# Altium project PicoDaisy.PrjPcb
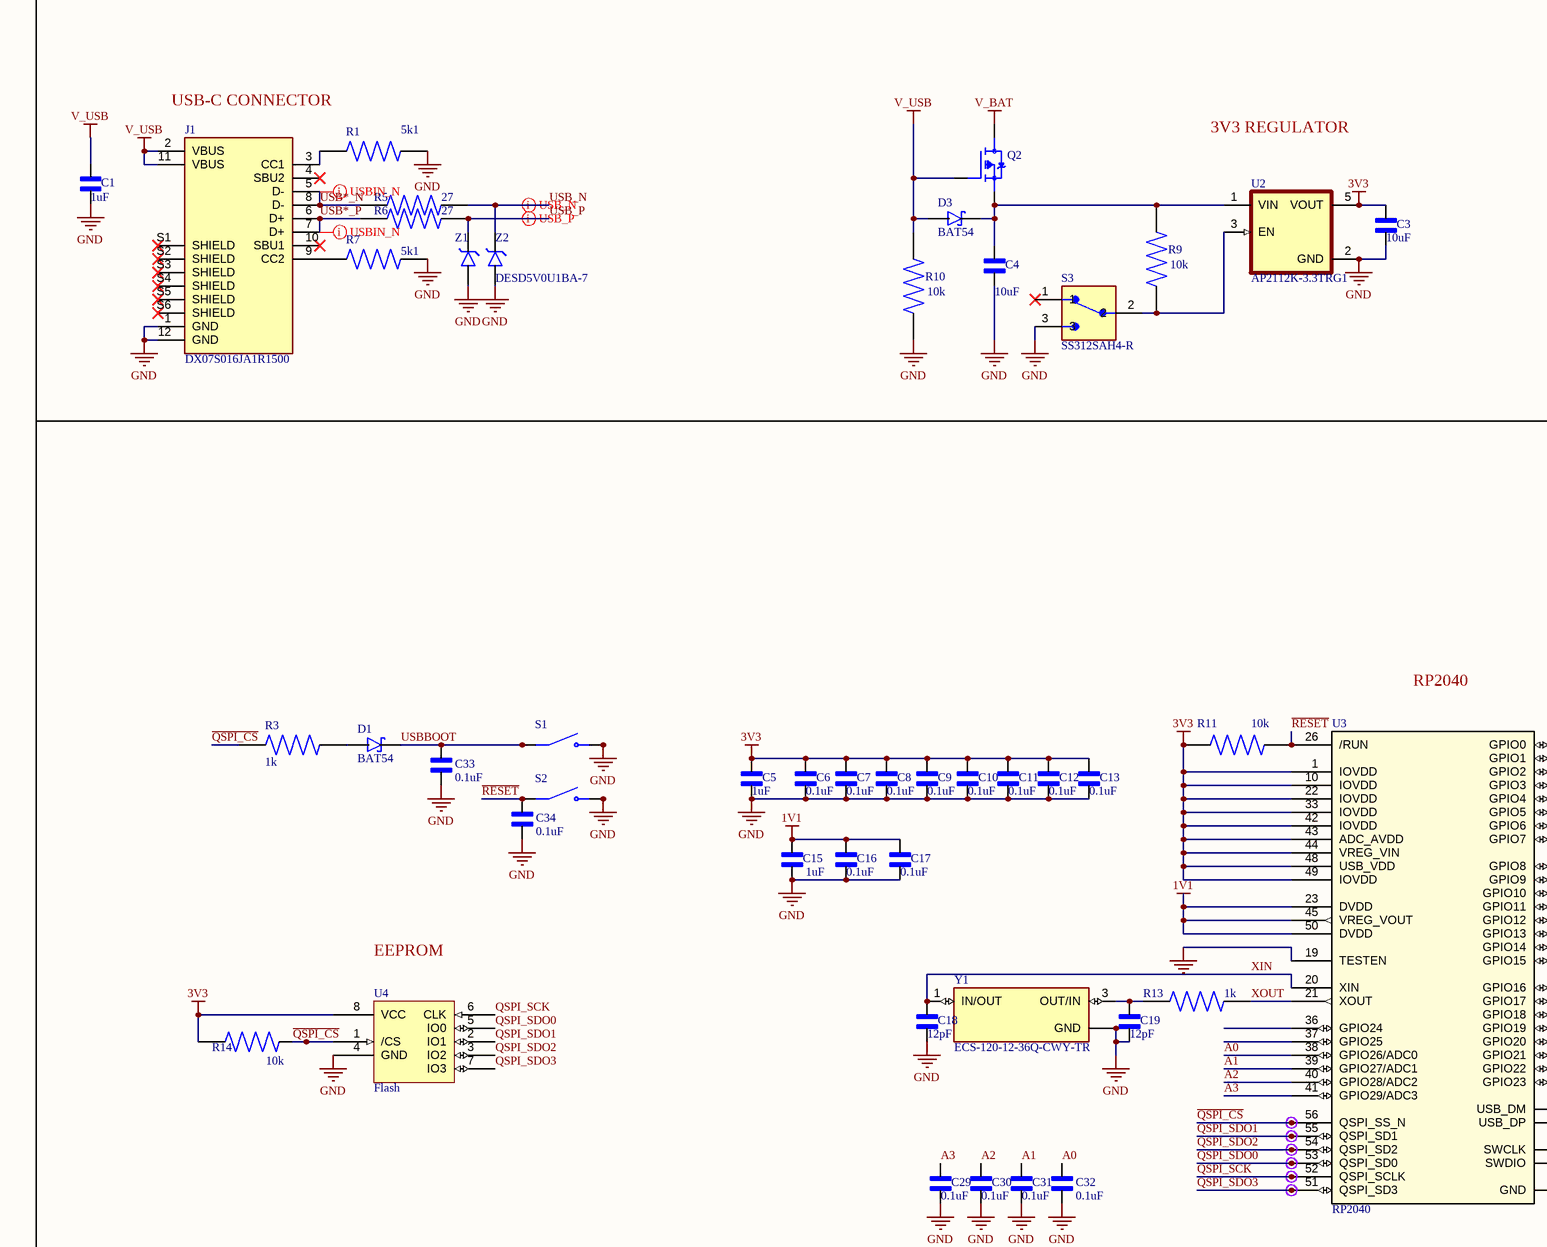
[diagram p0: PicoDaisy.SchDoc, top left]
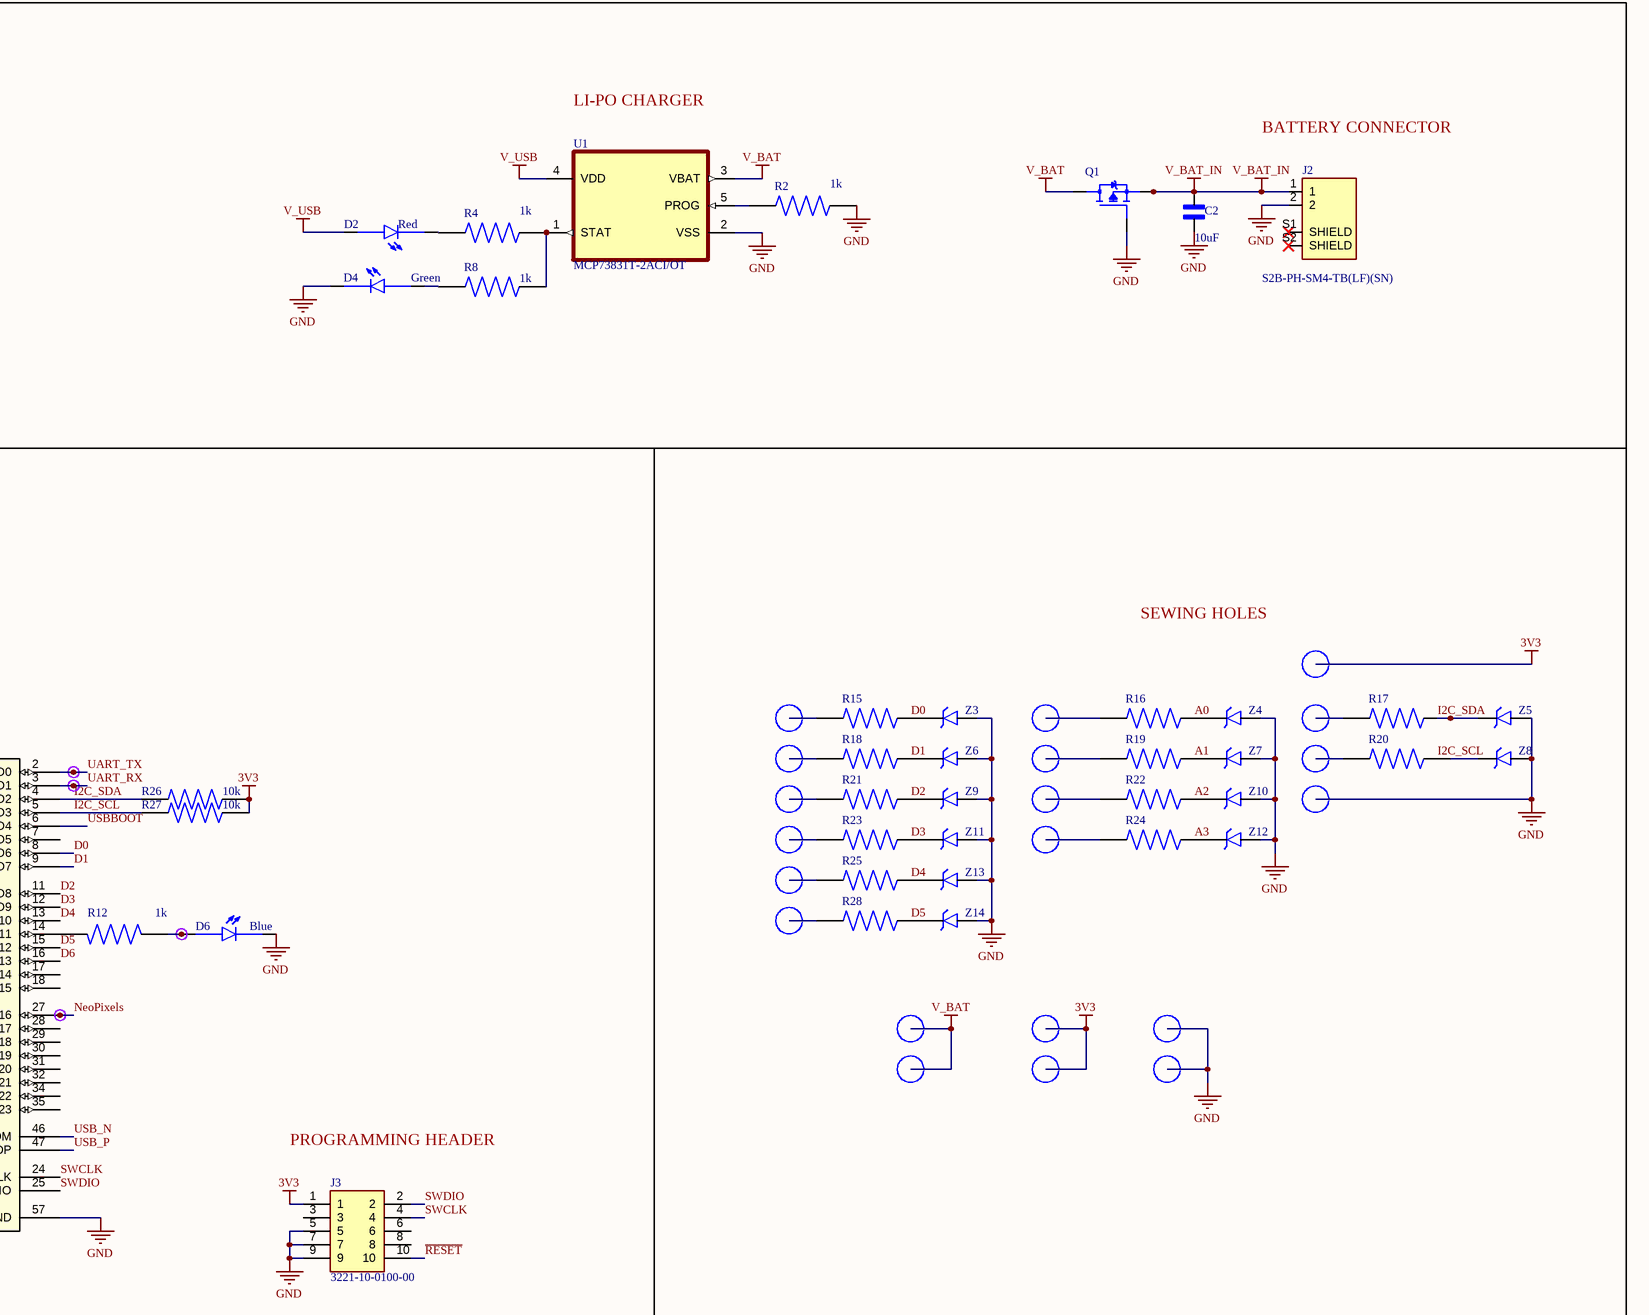
[diagram p1: PicoDaisy.SchDoc, top right]
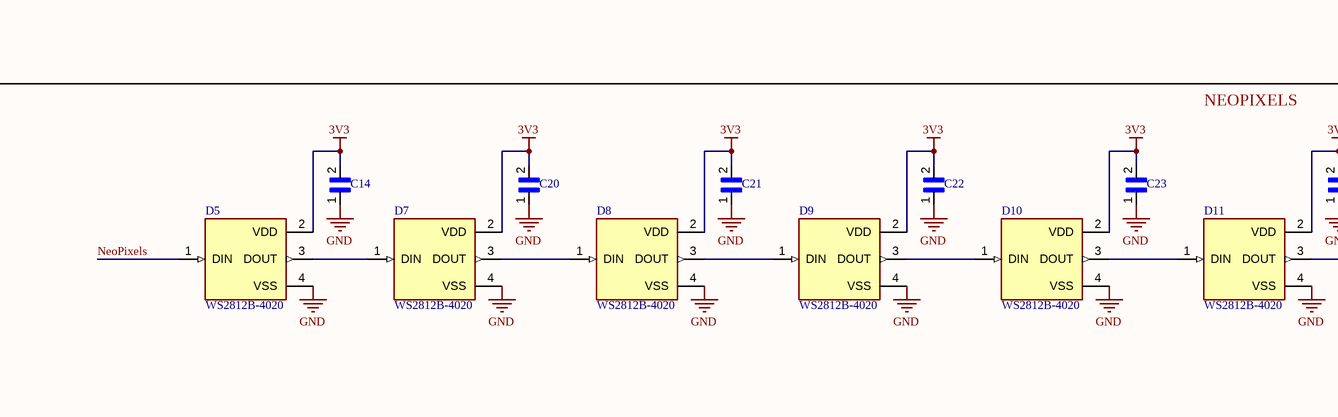
[diagram p2: PicoDaisy.SchDoc, bottom left]
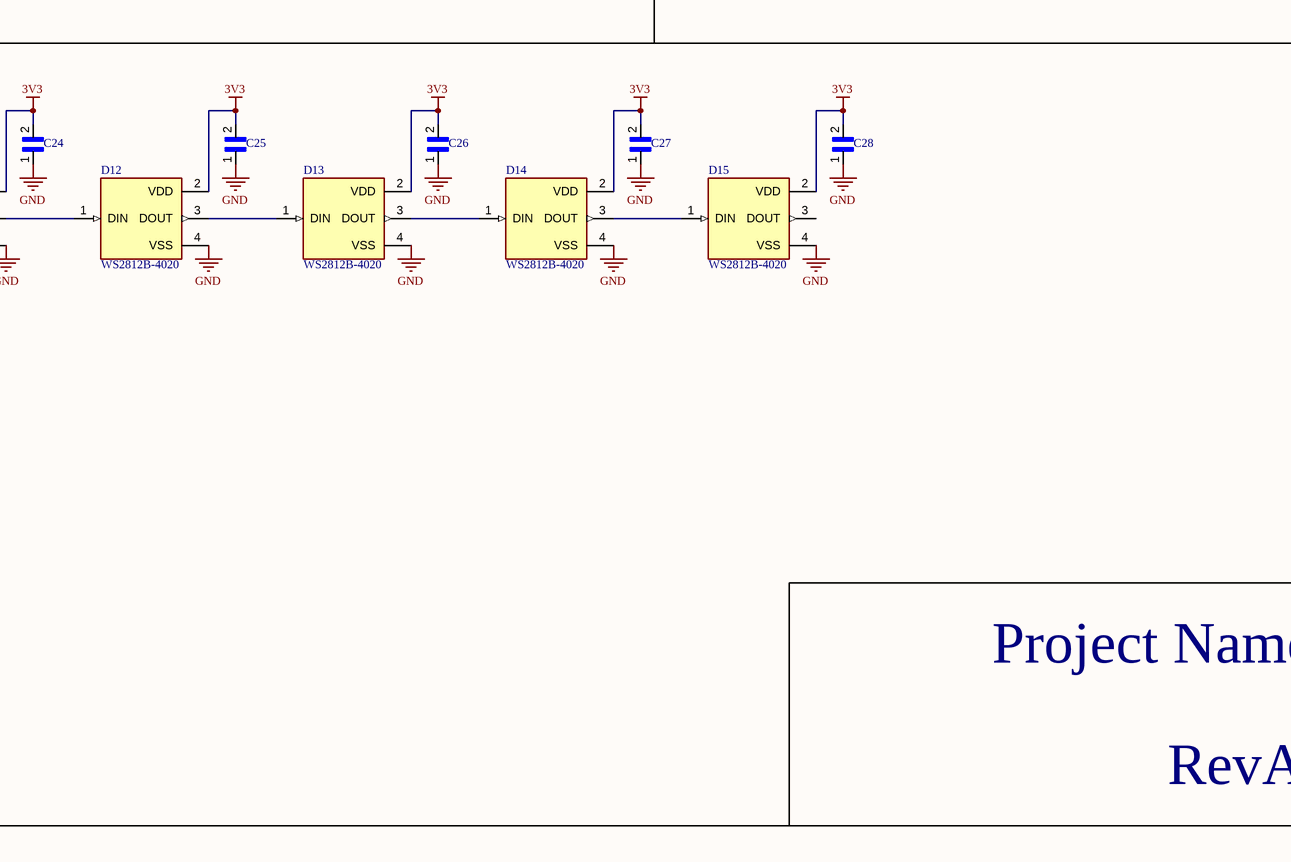
[diagram p3: PicoDaisy.SchDoc, bottom right]
1 sheet, 134 parts. Net scope: global (net labels, ports and power ports of the same name join across sheets).
Board file: PicoDaisy.PcbDoc

## Sheet PicoDaisy.SchDoc
size 594 x 420 mm; SheetNumber: 1; SheetTotal: 1

### Parts
C1  value 1uF  [CAPC1608X100N]  (hidden comment: GRM188R61E106KA73J)
C2  value 10uF  [CAPC1608X100N]  (hidden comment: GRM188R61E106KA73J)
C3  value 10uF  [CAPC1608X100N]  (hidden comment: GRM188R61E106KA73J)
C4  value 10uF  [CAPC1608X100N]  (hidden comment: GRM188R61E106KA73J)
C5  value 1uF  [CAPC1608X100N]  (hidden comment: GRM188R61E106KA73J)
C6  value 0.1uF  [CAPC1608X100N]  (hidden comment: GRM188R61E106KA73J)
C7  value 0.1uF  [CAPC1608X100N]  (hidden comment: GRM188R61E106KA73J)
C8  value 0.1uF  [CAPC1608X100N]  (hidden comment: GRM188R61E106KA73J)
C9  value 0.1uF  [CAPC1608X100N]  (hidden comment: GRM188R61E106KA73J)
C10  value 0.1uF  [CAPC1608X100N]  (hidden comment: GRM188R61E106KA73J)
C11  value 0.1uF  [CAPC1608X100N]  (hidden comment: GRM188R61E106KA73J)
C12  value 0.1uF  [CAPC1608X100N]  (hidden comment: GRM188R61E106KA73J)
C13  value 0.1uF  [CAPC1608X100N]  (hidden comment: GRM188R61E106KA73J)
C14  C0603X104K5RAC7867  [CAPC1608X100N]  (value not drawn)
C15  value 1uF  [CAPC1608X100N]  (hidden comment: GRM188R61E106KA73J)
C16  value 0.1uF  [CAPC1608X100N]  (hidden comment: GRM188R61E106KA73J)
C17  value 0.1uF  [CAPC1608X100N]  (hidden comment: GRM188R61E106KA73J)
C18  value 12pF  [CAPC1608X100N]  (hidden comment: GRM188R61E106KA73J)
C19  value 12pF  [CAPC1608X100N]  (hidden comment: GRM188R61E106KA73J)
C20  C0603X104K5RAC7867  [CAPC1608X100N]  (value not drawn)
C21  C0603X104K5RAC7867  [CAPC1608X100N]  (value not drawn)
C22  C0603X104K5RAC7867  [CAPC1608X100N]  (value not drawn)
C23  C0603X104K5RAC7867  [CAPC1608X100N]  (value not drawn)
C24  C0603X104K5RAC7867  [CAPC1608X100N]  (value not drawn)
C25  C0603X104K5RAC7867  [CAPC1608X100N]  (value not drawn)
C26  C0603X104K5RAC7867  [CAPC1608X100N]  (value not drawn)
C27  C0603X104K5RAC7867  [CAPC1608X100N]  (value not drawn)
C28  C0603X104K5RAC7867  [CAPC1608X100N]  (value not drawn)
C29  value 0.1uF  [CAPC1608X100N]  (hidden comment: GRM188R61E106KA73J)
C30  value 0.1uF  [CAPC1608X100N]  (hidden comment: GRM188R61E106KA73J)
C31  value 0.1uF  [CAPC1608X100N]  (hidden comment: GRM188R61E106KA73J)
C32  value 0.1uF  [CAPC1608X100N]  (hidden comment: GRM188R61E106KA73J)
C33  value 0.1uF  [CAPC1608X100N]  (hidden comment: GRM188R61E106KA73J)
C34  value 0.1uF  [CAPC1608X100N]  (hidden comment: GRM188R61E106KA73J)
D1  BAT54  [SOT23]
D2  Red  [LEDC1608X35N]
D3  BAT54  [SOT23]
D4  Green  [LEDC1608X35N]
D5  WS2812B-4020  [LED_WS2812B-4020]
D6  Blue  [LEDC1608X35N]
D7  WS2812B-4020  [LED_WS2812B-4020]
D8  WS2812B-4020  [LED_WS2812B-4020]
D9  WS2812B-4020  [LED_WS2812B-4020]
D10  WS2812B-4020  [LED_WS2812B-4020]
D11  WS2812B-4020  [LED_WS2812B-4020]
D12  WS2812B-4020  [LED_WS2812B-4020]
D13  WS2812B-4020  [LED_WS2812B-4020]
D14  WS2812B-4020  [LED_WS2812B-4020]
D15  WS2812B-4020  [LED_WS2812B-4020]
J1  DX07S016JA1R1500  [JAE_DX07S016JA1R1500]
J2  S2B-PH-SM4-TB(LF)(SN)  [JST_S2B-PH-SM4-TB(LF)(SN)]
J3  3221-10-0100-00  [CNC_3221-10-0100-00]
Q1  IRLML6401TRPBF  [SOT23]  (value not drawn)
Q2  IRLML6401TRPBF  [SOT23]  (value not drawn)
R1  value 5k1  [RESC1508X55N]  (hidden comment: MCT0603HC1001FP100)
R2  value 1k  [RESC1508X55N]  (hidden comment: MCT0603HC1001FP100)
R3  value 1k  [RESC1508X55N]  (hidden comment: MCT0603HC1001FP100)
R4  value 1k  [RESC1508X55N]  (hidden comment: MCT0603HC1001FP100)
R5  value 27  [RESC1508X55N]  (hidden comment: MCT0603HC1001FP100)
R6  value 27  [RESC1508X55N]  (hidden comment: MCT0603HC1001FP100)
R7  value 5k1  [RESC1508X55N]  (hidden comment: MCT0603HC1001FP100)
R8  value 1k  [RESC1508X55N]  (hidden comment: MCT0603HC1001FP100)
R9  value 10k  [RESC1508X55N]  (hidden comment: MCT0603HC1001FP100)
R10  value 10k  [RESC1508X55N]  (hidden comment: MCT0603HC1001FP100)
R11  value 10k  [RESC1508X55N]
R12  value 1k  [RESC1508X55N]  (hidden comment: MCT0603HC1001FP100)
R13  value 1k  [RESC1508X55N]  (hidden comment: MCT0603HC1001FP100)
R14  value 10k  [RESC1508X55N]  (hidden comment: MCT0603HC1001FP100)
R15  MCT0603HC1001FP100  [RESC1508X55N]  (value not drawn)
R16  MCT0603HC1001FP100  [RESC1508X55N]  (value not drawn)
R17  MCT0603HC1001FP100  [RESC1508X55N]  (value not drawn)
R18  MCT0603HC1001FP100  [RESC1508X55N]  (value not drawn)
R19  MCT0603HC1001FP100  [RESC1508X55N]  (value not drawn)
R20  MCT0603HC1001FP100  [RESC1508X55N]  (value not drawn)
R21  MCT0603HC1001FP100  [RESC1508X55N]  (value not drawn)
R22  MCT0603HC1001FP100  [RESC1508X55N]  (value not drawn)
R23  MCT0603HC1001FP100  [RESC1508X55N]  (value not drawn)
R24  MCT0603HC1001FP100  [RESC1508X55N]  (value not drawn)
R25  MCT0603HC1001FP100  [RESC1508X55N]  (value not drawn)
R26  value 10k  [RESC1508X55N]  (hidden comment: MCT0603HC1001FP100)
R27  value 10k  [RESC1508X55N]  (hidden comment: MCT0603HC1001FP100)
R28  MCT0603HC1001FP100  [RESC1508X55N]  (value not drawn)
S1  PTS_647_SM38_SMTR2_LFS  [SW_PTS_647_SM38_SMTR2_LFS]  (value not drawn)
S2  PTS_647_SM38_SMTR2_LFS  [SW_PTS_647_SM38_SMTR2_LFS]  (value not drawn)
S3  SS312SAH4-R  [SW_SS312SAH4-R]
SH1  SewingHole  [SewingHole]  (value not drawn)
SH2  SewingHole  [SewingHole]  (value not drawn)
SH3  SewingHole  [SewingHole]  (value not drawn)
SH4  SewingHole  [SewingHole]  (value not drawn)
SH5  SewingHole  [SewingHole]  (value not drawn)
SH6  SewingHole  [SewingHole]  (value not drawn)
SH7  SewingHole  [SewingHole]  (value not drawn)
SH8  SewingHole  [SewingHole]  (value not drawn)
SH9  SewingHole  [SewingHole]  (value not drawn)
SH10  SewingHole  [SewingHole]  (value not drawn)
SH11  SewingHole  [SewingHole]  (value not drawn)
SH12  SewingHole  [SewingHole]  (value not drawn)
SH13  SewingHole  [SewingHole]  (value not drawn)
SH14  SewingHole  [SewingHole]  (value not drawn)
SH15  SewingHole  [SewingHole]  (value not drawn)
SH16  SewingHole  [SewingHole]  (value not drawn)
SH17  SewingHole  [SewingHole]  (value not drawn)
SH18  SewingHole  [SewingHole]  (value not drawn)
SH19  SewingHole  [SewingHole]  (value not drawn)
SH?  SewingHole  [SewingHole]  (value not drawn)
TP1  TestPoint  [TP]  (value not drawn)
TP2  TestPoint  [TP]  (value not drawn)
TP4  TestPoint  [TP]  (value not drawn)
TP5  TestPoint  [TP]  (value not drawn)
TP7  TestPoint  [TP]  (value not drawn)
TP9  TestPoint  [TP]  (value not drawn)
TP10  TestPoint  [TP]  (value not drawn)
TP11  TestPoint  [TP]  (value not drawn)
TP12  TestPoint  [TP]  (value not drawn)
TP14  TestPoint  [TP]  (value not drawn)
U1  MCP73831T-2ACI/OT  [SOT95P280X145-5N]
U2  AP2112K-3.3TRG1  [SOT95P285X140-5N]
U3  RP2040  [IC57_RP2040]
U4  Flash  [SOIC127P790X216-8N]
Y1  ECS-120-12-36Q-CWY-TR  [XTAL_ECS-120-12-36Q-CWY-TR]
Z1  DESD5V0U1BA-7  [SOD2513X120N]  (value not drawn)
Z2  DESD5V0U1BA-7  [SOD2513X120N]
Z3  DESD5V0U1BA-7  [SOD2513X120N]  (value not drawn)
Z4  DESD5V0U1BA-7  [SOD2513X120N]  (value not drawn)
Z5  DESD5V0U1BA-7  [SOD2513X120N]  (value not drawn)
Z6  DESD5V0U1BA-7  [SOD2513X120N]  (value not drawn)
Z7  DESD5V0U1BA-7  [SOD2513X120N]  (value not drawn)
Z8  DESD5V0U1BA-7  [SOD2513X120N]  (value not drawn)
Z9  DESD5V0U1BA-7  [SOD2513X120N]  (value not drawn)
Z10  DESD5V0U1BA-7  [SOD2513X120N]  (value not drawn)
Z11  DESD5V0U1BA-7  [SOD2513X120N]  (value not drawn)
Z12  DESD5V0U1BA-7  [SOD2513X120N]  (value not drawn)
Z13  DESD5V0U1BA-7  [SOD2513X120N]  (value not drawn)
Z14  DESD5V0U1BA-7  [SOD2513X120N]  (value not drawn)

### Nets
1V1: C15.2 C16.2 C17.2 U3.23(DVDD) U3.45(VREG_VOUT) U3.50(DVDD)
3V3: C3.2 C5.2 C6.2 C7.2 C8.2 C9.2 C10.2 C11.2 C12.2 C13.2 C14.2 C20.2 C21.2 C22.2 C23.2 C24.2 C25.2 C26.2 C27.2 C28.2 D5.2(VDD) D7.2(VDD) D8.2(VDD) D9.2(VDD) D10.2(VDD) D11.2(VDD) D12.2(VDD) D13.2(VDD) D14.2(VDD) D15.2(VDD) J3.1 R11.1 R14.2 R26.2 R27.2 SH9.1 SH12.1 SH?.1 U2.5(VOUT) U3.1(IOVDD) U3.10(IOVDD) U3.22(IOVDD) U3.33(IOVDD) U3.42(IOVDD) U3.43(ADC_AVDD) U3.44(VREG_VIN) U3.48(USB_VDD) U3.49(IOVDD) U4.8(VCC)
GND: C1.1 C2.1 C3.1 C4.1 C5.1 C6.1 C7.1 C8.1 C9.1 C10.1 C11.1 C12.1 C13.1 C14.1 C15.1 C16.1 C17.1 C18.1 C19.1 C20.1 C21.1 C22.1 C23.1 C24.1 C25.1 C26.1 C27.1 C28.1 C29.1 C30.1 C31.1 C32.1 C33.1 C34.1 D4.C D5.4(VSS) D6.C D7.4(VSS) D8.4(VSS) D9.4(VSS) D10.4(VSS) D11.4(VSS) D12.4(VSS) D13.4(VSS) D14.4(VSS) D15.4(VSS) J1.1(GND) J1.12(GND) J2.2 J3.5 J3.7 J3.9 Q1.1(G) R1.2 R2.2 R7.2 R10.1 S1.1(NO) S1.2(NO) S2.1(NO) S2.2(NO) S3.3 SH10.1 SH13.1 SH15.1 U1.2(VSS) U2.2(GND) U3.19(TESTEN) U3.57(GND) U4.4(GND) Y1.2(GND) Y1.4(GND) Z1.2(A) Z2.2(A) Z3.2(A) Z4.2(A) Z5.2(A) Z6.2(A) Z7.2(A) Z8.2(A) Z9.2(A) Z10.2(A) Z11.2(A) Z12.2(A) Z13.2(A) Z14.2(A)
V_BAT: Q1.3(D) Q2.3(D) SH4.1 SH7.1 U1.3(VBAT)
V_BAT_IN: C2.2 J2.1 Q1.2(S)
V_USB: C1.2 D2.A D3.1(A) J1.2(VBUS) J1.11(VBUS) Q2.1(G) R10.2 U1.4(VDD)
~{QSPI_CS}: R3.2 R14.1 TP7.1 U3.56(QSPI_SS_N) U4.1(/CS)
~{RESET}: C34.2 J3.10 R11.2 S2.3(COM) S2.4(COM) U3.26(/RUN)
A0: C32.2 U3.38(GPIO26/ADC0)
A1: C31.2 U3.39(GPIO27/ADC1)
A2: C30.2 U3.40(GPIO28/ADC2)
A3: C29.2 U3.41(GPIO29/ADC3)
D0: U3.8(GPIO6)
D1: U3.9(GPIO7)
D2: U3.11(GPIO8)
D3: U3.12(GPIO9)
D4: U3.13(GPIO10)
D5: U3.15(GPIO12)
D6: U3.16(GPIO13)
I2C_SCL: R27.1 U3.5(GPIO3)
I2C_SDA: R17.2 R26.1 U3.4(GPIO2) Z5.1(K)
NeoPixels: D5.1(DIN) TP5.1 U3.27(GPIO16)
QSPI_SCK: TP12.1 U3.52(QSPI_SCLK) U4.6(CLK)
QSPI_SDO0: TP11.1 U3.53(QSPI_SD0) U4.5(IO0)
QSPI_SDO1: TP9.1 U3.55(QSPI_SD1) U4.2(IO1)
QSPI_SDO2: TP10.1 U3.54(QSPI_SD2) U4.3(IO2)
QSPI_SDO3: TP14.1 U3.51(QSPI_SD3) U4.7(IO3)
SWCLK: J3.4 U3.24(SWCLK)
SWDIO: J3.2 U3.25(SWDIO)
UART_RX: TP2.1 U3.3(GPIO1)
UART_TX: TP1.1 U3.2(GPIO0)
USB*_N: J1.5(D-) J1.8(D-) R5.1
USB*_P: J1.6(D+) J1.7(D+) R6.1
USB_N: R5.2 U3.46(USB_DM) Z2.1(K)
USB_P: R6.2 U3.47(USB_DP) Z1.1(K)
USBBOOT: C33.2 D1.3(K) S1.3(COM) S1.4(COM) U3.6(GPIO4)
XIN: C18.2 U3.20(XIN) Y1.1(IN/OUT)
XOUT: R13.1 U3.21(XOUT)
NetC4_2: C4.2 D3.3(K) Q2.2(S) R9.2 U2.1(VIN)
NetC19_2: C19.2 R13.2 Y1.3(OUT/IN)
NetD1_1: D1.1(A) R3.1
NetD2_C: D2.C R4.1
NetD4_A: D4.A R8.1
NetD5_3: D5.3(DOUT) D7.1(DIN)
NetD6_A: D6.A R12.1 TP4.1
NetD7_3: D7.3(DOUT) D8.1(DIN)
NetD8_3: D8.3(DOUT) D9.1(DIN)
NetD9_3: D9.3(DOUT) D10.1(DIN)
NetD10_3: D10.3(DOUT) D11.1(DIN)
NetD11_3: D11.3(DOUT) D12.1(DIN)
NetD12_3: D12.3(DOUT) D13.1(DIN)
NetD13_3: D13.3(DOUT) D14.1(DIN)
NetD14_3: D14.3(DOUT) D15.1(DIN)
NetJ1_3: J1.3(CC1) R1.1
NetJ1_9: J1.9(CC2) R7.1
NetR2_1: R2.1 U1.5(PROG)
NetR4_2: R4.2 R8.2 U1.1(STAT)
NetR9_1: R9.1 S3.2 U2.3(EN)
NetR12_2: R12.2 U3.14(GPIO11)
NetR15_1: R15.1 SH1.1
NetR15_2: R15.2 Z3.1(K)
NetR16_1: R16.1 SH2.1
NetR16_2: R16.2 Z4.1(K)
NetR17_1: R17.1 SH3.1
NetR18_1: R18.1 SH11.1
NetR18_2: R18.2 Z6.1(K)
NetR19_1: R19.1 SH5.1
NetR19_2: R19.2 Z7.1(K)
NetR20_1: R20.1 SH6.1
NetR20_2: R20.2 Z8.1(K)
NetR21_1: R21.1 SH14.1
NetR21_2: R21.2 Z9.1(K)
NetR22_1: R22.1 SH8.1
NetR22_2: R22.2 Z10.1(K)
NetR23_1: R23.1 SH16.1
NetR23_2: R23.2 Z11.1(K)
NetR24_1: R24.1 SH17.1
NetR24_2: R24.2 Z12.1(K)
NetR25_1: R25.1 SH18.1
NetR25_2: R25.2 Z13.1(K)
NetR28_1: R28.1 SH19.1
NetR28_2: R28.2 Z14.1(K)

Not connected (* = marked no-connect by the designer): D15 3(DOUT); J1 4(SBU2)* 10(SBU1)* S1(SHIELD)* S2(SHIELD)* S3(SHIELD)* S4(SHIELD)* S5(SHIELD)* S6(SHIELD)*; J2 S1(SHIELD)* S2(SHIELD)*; J3 3 6 8; S3 1*; U3 7(GPIO5) 17(GPIO14) 18(GPIO15) 28(GPIO17) 29(GPIO18) 30(GPIO19) 31(GPIO20) 32(GPIO21) 34(GPIO22) 35(GPIO23) 36(GPIO24) 37(GPIO25)

### Layout directives
differential pair: USB*_N, USB*_P, USB_N, USB_P

### Notes on the sheet
- USB-C CONNECTOR
- LI-PO CHARGER
- BATTERY CONNECTOR
- 3V3 REGULATOR
- SEWING HOLES
- RP2040
- EEPROM
- PROGRAMMING HEADER
- NEOPIXELS
- Project Name:Pico Daisy
- RevA
- Labels drawn without touching a wire or pin: A0, A1, A2, A3, D0, D1, D2, D3, D4, D5, I2C_SCL

### Library data of the parts
C1-C13 C15-C19 C29-C34 = GRM188R61E106KA73J: SMD Capacitor X5R(EIA) with Capacitance: 10uF Tol. 10%. Rated Voltage: 25Vdc; Package: None; Price: None; MP: GRM188R61E106KA73J; Availability: Unavailable
C14 C20-C28 = GRM188R61E106KA73J: CAP CER 0.1UF 50V X7R 0603; Package: None; Price: None; Value: *; MP: C0603X104K5RAC7867; Availability: Unavailable
D1 D3 = BAT54: Diode Schottky 30V 200mA Surface Mount SOT-23-3 _TO-236_; MF: ON Semiconductor; MP: BAT54; Package: SOT-23-3 ON Semiconductor; Price: None; Availability: Unavailable; Value: *; SnapEDA_Link: https://www.snapeda.com/parts/BAT54/ON%20Semiconductor/view-part/1356687/?ref=snap
D2 D4 D6 = LTST-C190KRKT: Red 631nm LED Indication - Discrete 2V 0603 (1608 Metric); MF: Lite-On Inc.; SnapEDA_Link: https://www.snapeda.com/parts/LTST-C190KRKT/Lite-On+Inc./view-part/?ref=snap; Package: 0603 Lite-On; Value: *; MP: LTST-C190KRKT; Check_prices: https://www.snapeda.com/parts/LTST-C190KRKT/Lite-On+Inc./view-part/?ref=eda
D5 D7-D15 = WS2812B-4020: 12mA RGB SMD,2x4mm Light Emitting Diodes; MF: Worldsemi; Price: None; MP: WS2812B-4020; Availability: Not in stock; SnapEDA_Link: https://www.snapeda.com/parts/WS2812B-4020/Worldsemi/view-part/?ref=snap; Check_prices: https://www.snapeda.com/parts/WS2812B-4020/Worldsemi/view-part/?ref=eda; Value: *; Package: Package
J1 = DX07S016JA1R1500: USB-C (USB TYPE-C) USB 2.0 Receptacle Connector 24 (16+8 Dummy) Position Surface Mount, Right Angle; Through Hole; Package: None; Value: *; Price: None; MP: DX07S016JA1R1500; Availability: Unavailable
J2 = S2B-PH-SM4-TB(LF)(SN): Connector Header Surface Mount, Right Angle 2 position 0.079 (2.00mm); MF: JST Sales; Value: *; SnapEDA_Link: https://www.snapeda.com/parts/S2B-PH-SM4-TB(LF)(SN)/JST+Sales+America+Inc./view-part/?ref=snap; Purchase-URL: https://pricing.snapeda.com/search/part/S2B-PH-SM4-TB(LF)(SN)/?ref=eda; Check_prices: https://www.snapeda.com/parts/S2B-PH-SM4-TB(LF)(SN)/JST+Sales+America+Inc./view-part/?ref=eda; Digi-Key_Part_Number: 455-1749-2-ND; Package: None; MP: S2B-PH-SM4-TB(LF)(SN)
J3 = 3221-10-0100-00: Connector Header Through Hole 10 position 0.050 _1.27mm_; MF: CNC Tech; Digi-Key_Part_Number: 1175-1733-ND; SnapEDA_Link: https://www.snapeda.com/parts/3221-10-0100-00/CNC%20Tech/view-part/596947/?ref=snap; Digi-Key_Purchase_URL: https://www.digikey.com/product-detail/en/cnc-tech/3221-10-0100-00/1175-1733-ND/4878932?utm_source=snapeda&utm_medium=aggregator&utm_campaign=symbol; Package: None; Value: *; MP: 3221-10-0100-00
Q1 Q2 = BSS84: P-Channel 12 V 4.3A (Ta) 1.3W (Ta) Surface Mount Micro3™/SOT-23; MF: Infineon; Price: None; Availability: Good; Value: *; MP: IRLML6401TRPBF
R2 = MCT0603HC1001FP100: RES 1K OHM 1% 1/10W 0603; Package: None; Price: None; MP: MCT0603HC1001FP100; Availability: Unavailable
R11 = MCT0603HC1001FP100: Package: None; Price: None; MP: MCT0603HC1001FP100; Availability: Unavailable
S1 S2 = PTS_647_SM38_SMTR2_LFS: Tactile Switch SPST-NO Top Actuated Surface Mount; MF: C&K; MP: PTS 647 SM38 SMTR2 LFS; Purchase-URL: https://pricing.snapeda.com/search/part/PTS 647 SM38 SMTR2 LFS/?ref=eda; Package: None; Digi-Key_Part_Number: PTS647SM38SMTR2LFSTR-ND; Check_prices: https://www.snapeda.com/parts/PTS%20647%20SM38%20SMTR2%20LFS/C%2526K/view-part/?ref=eda; SnapEDA_Link: https://www.snapeda.com/parts/PTS%20647%20SM38%20SMTR2%20LFS/C%2526K/view-part/?ref=snap; Value: *
S3 = SS312SAH4-R: æ»‘åŠ¨å¼€å…³SPDTè¡¨é¢è´´è£…ï¼Œç›´è§’; MF: NKK Switches; Availability: Unavailable; Value: *; Package: None; Price: None; MP: SS312SAH4-R; SnapEDA_Link: https://www.snapeda.com/parts/SS312SAH4-R/NKK%20Switches/view-part/231456/?ref=snap
U1 = MCP73831T-2ACI/OT: Charger IC Lithium Ion/Polymer SOT-23-5; MF: Microchip; Package: SOT-23 Microchip; Purchase-URL: https://pricing.snapeda.com/search/part/MCP73831T-2ACI/OT/?ref=eda; MP: MCP73831T-2ACI/OT; Value: *; Availability: In Stock; SnapEDA_Link: https://www.snapeda.com/parts/MCP73831T-2ACI/OT/Microchip/view-part/?ref=snap; Price: None; Check_prices: https://www.snapeda.com/parts/MCP73831T-2ACI/OT/Microchip/view-part/?ref=eda
U2 = AP2112K-3.3TRG1: Linear Voltage Regulator IC Positive Fixed 1 Output 600mA SOT-25; MF: Diodes Inc.; Value: *; Purchase-URL: https://pricing.snapeda.com/search/part/AP2112K-3.3TRG1/?ref=eda; Package: SOT-753 Diodes Inc.; Availability: In Stock; Check_prices: https://www.snapeda.com/parts/AP2112K-3.3TRG1/Diodes+Inc./view-part/?ref=eda; Price: None; SnapEDA_Link: https://www.snapeda.com/parts/AP2112K-3.3TRG1/Diodes+Inc./view-part/?ref=snap; MP: AP2112K-3.3TRG1
U3 = RP2040: No Description Available; Mfr_Name: Raspberry Pi; RefDes: RefDes; Type: Type
U4 = W25Q64JVSSIQ: FLASH - NOR Memory IC 64Mbit SPI - Quad I/O 133 MHz 8-SOIC; MPN: W25Q64JVSSIQ
Y1 = ECS-120-12-36Q-CWY-TR: 12MHz Â±10ppm Crystal 12pF 150 Ohms 4-SMD, No Lead; MF: ECS Inc.; Digi-Key_Part_Number: XC2419CT-ND; SnapEDA_Link: https://www.snapeda.com/parts/ECS-120-12-36Q-CWY-TR/ECS%20Inc./view-part/2122498/?ref=snap; Value: *; Package: SMD-4 ECS International; MP: ECS-120-12-36Q-CWY-TR
R1 R3-R10 R12-R28 = MCT0603HC1001FP100: Package: None; Price: None; MP: MCT0603HC1001FP100; Availability: Unavailable
  R15-R25 R28: Value: *
Z1-Z14 = DESD5V0U1BA-7: MFN: DESD5V0U1BA-7